# EAGLE schematic pulser (EAGLE 9.5.0)
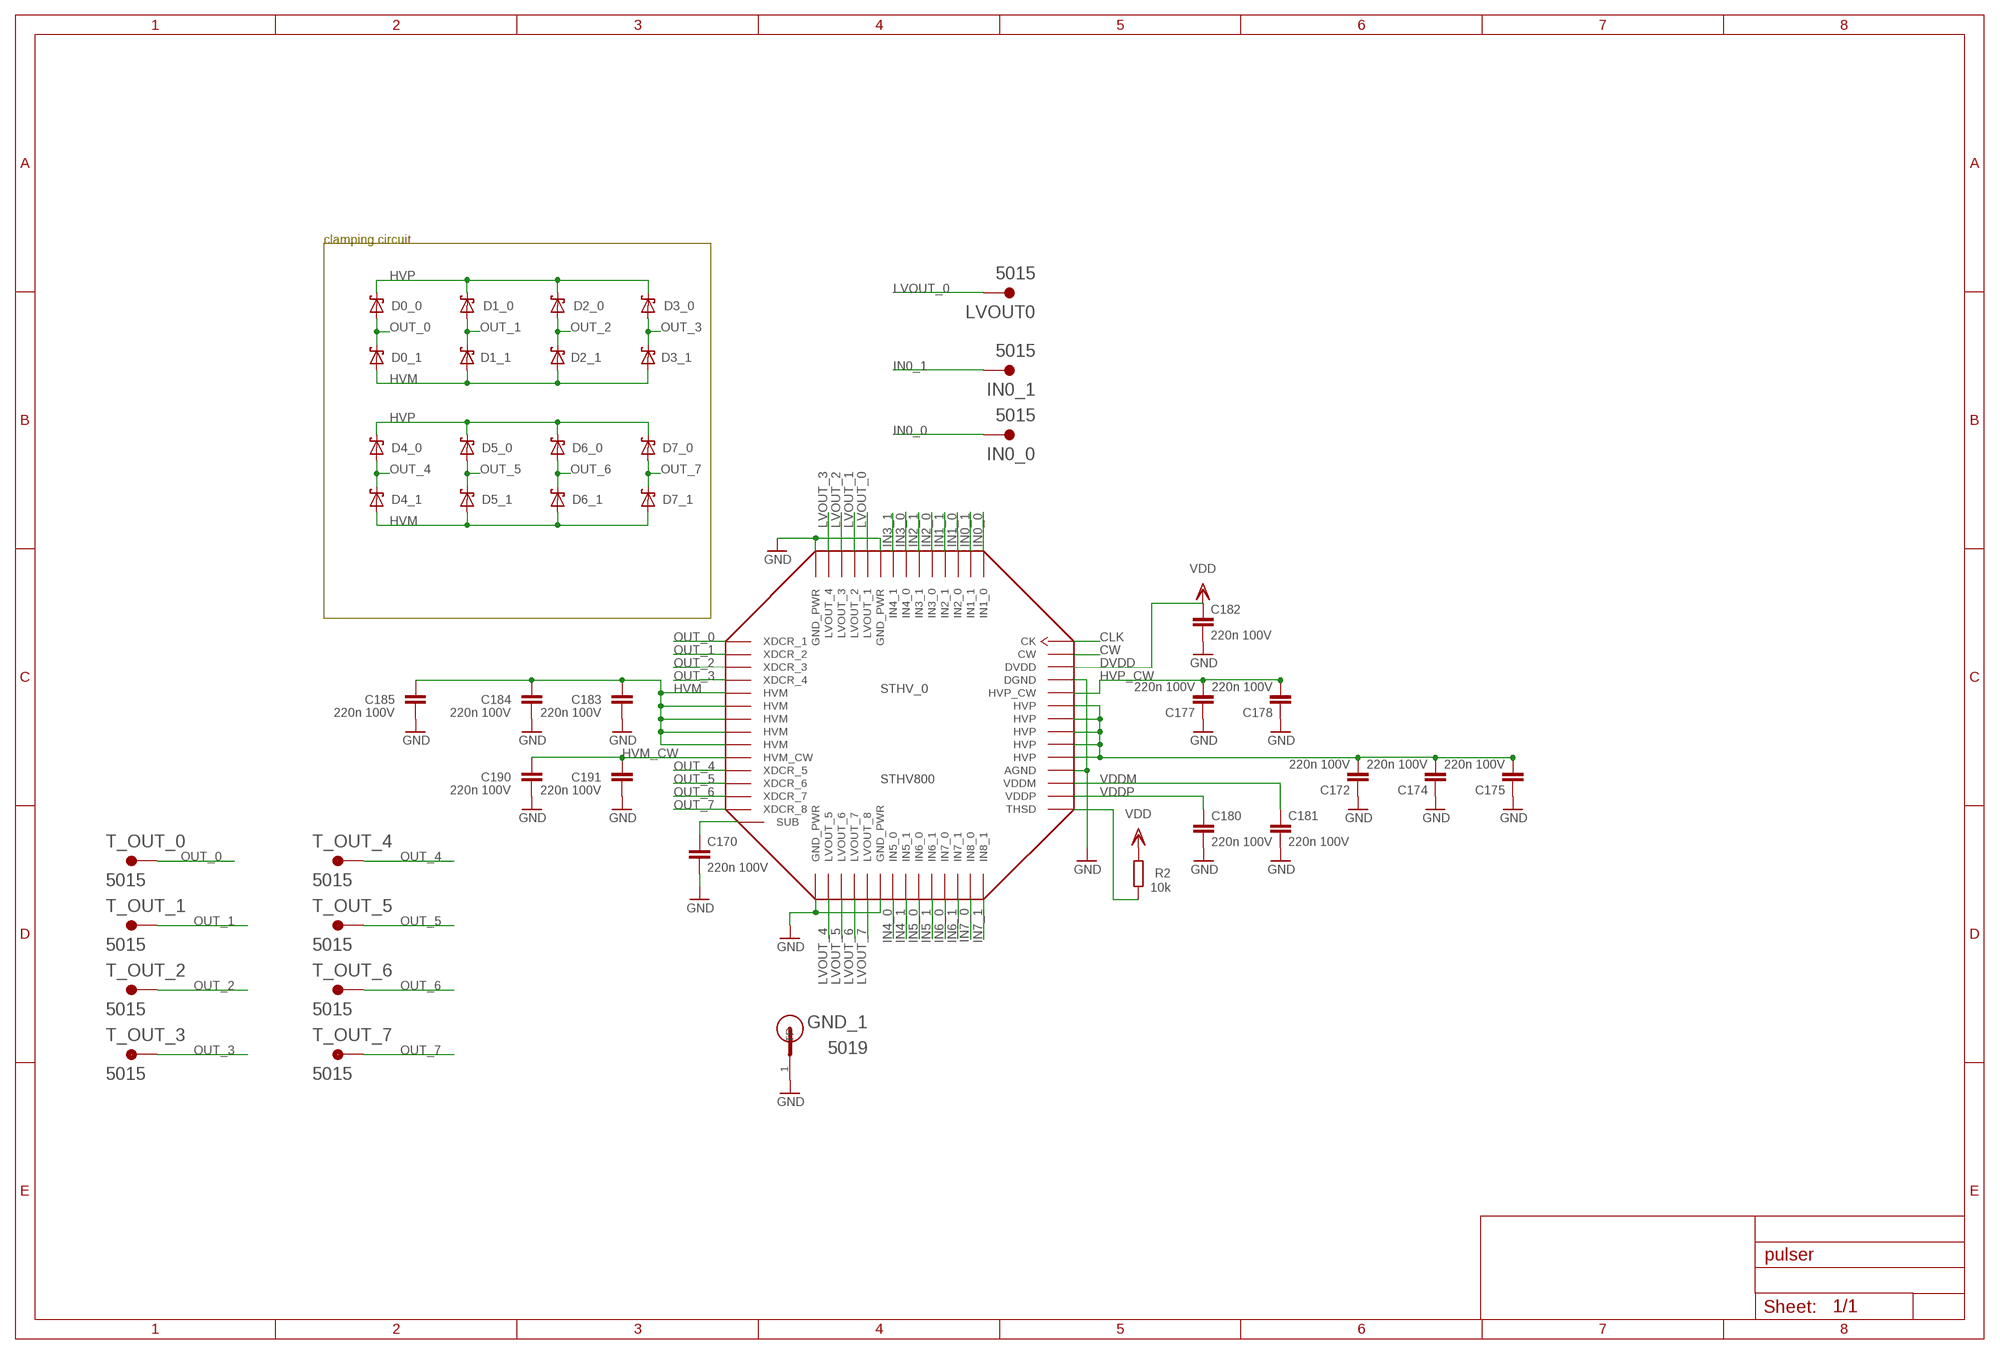
[diagram p0: schematic, sheet 1]

## Parts
C170  220n 100V  C-EUC0805  [C0805]
C172  220n 100V  C-EUC0805  [C0805]
C174  220n 100V  C-EUC0805  [C0805]
C175  220n 100V  C-EUC0805  [C0805]
C177  220n 100V  C-EUC0805  [C0805]
C178  220n 100V  C-EUC0805  [C0805]
C180  220n 100V  C-EUC0805  [C0805]
C181  220n 100V  C-EUC0805  [C0805]
C182  220n 100V  C-EUC0805  [C0805]
C183  220n 100V  C-EUC0805  [C0805]
C184  220n 100V  C-EUC0805  [C0805]
C185  220n 100V  C-EUC0805  [C0805]
C190  220n 100V  C-EUC0805  [C0805]
C191  220n 100V  C-EUC0805  [C0805]
D0_0  SBR1U200P1SBR1U200P1  [POWERDI-123]
D0_1  SBR1U200P1SBR1U200P1  [POWERDI-123]
D1_0  SBR1U200P1SBR1U200P1  [POWERDI-123]
D1_1  SBR1U200P1SBR1U200P1  [POWERDI-123]
D2_0  SBR1U200P1SBR1U200P1  [POWERDI-123]
D2_1  SBR1U200P1SBR1U200P1  [POWERDI-123]
D3_0  SBR1U200P1SBR1U200P1  [POWERDI-123]
D3_1  SBR1U200P1SBR1U200P1  [POWERDI-123]
D4_0  SBR1U200P1SBR1U200P1  [POWERDI-123]
D4_1  SBR1U200P1SBR1U200P1  [POWERDI-123]
D5_0  SBR1U200P1SBR1U200P1  [POWERDI-123]
D5_1  SBR1U200P1SBR1U200P1  [POWERDI-123]
D6_0  SBR1U200P1SBR1U200P1  [POWERDI-123]
D6_1  SBR1U200P1SBR1U200P1  [POWERDI-123]
D7_0  SBR1U200P1SBR1U200P1  [POWERDI-123]
D7_1  SBR1U200P1SBR1U200P1  [POWERDI-123]
GND_1  5019  [TP380X203]
IN0_0  5015  [KEYSTONE_5015]
IN0_1  5015  [KEYSTONE_5015]
LVOUT0  5015  [KEYSTONE_5015]
R2  10k  R-EU_R0805  [R0805]
STHV_0  STHV800  [TFLGA-56LD]
T_OUT_0  5015  [KEYSTONE_5015]
T_OUT_1  5015  [KEYSTONE_5015]
T_OUT_2  5015  [KEYSTONE_5015]
T_OUT_3  5015  [KEYSTONE_5015]
T_OUT_4  5015  [KEYSTONE_5015]
T_OUT_5  5015  [KEYSTONE_5015]
T_OUT_6  5015  [KEYSTONE_5015]
T_OUT_7  5015  [KEYSTONE_5015]

## Nets
CLK: STHV_0.CK
CW: STHV_0.CW
DVDD: C182.1 STHV_0.DVDD
GND [power_cw]: C170.2 C172.1 C174.1 C175.1 C177.1 C178.1 C180.2 C181.2 C182.2 C183.2 C184.2 C185.2 C190.1 C191.1 GND_1.1(TP) STHV_0.AGND STHV_0.DGND STHV_0.GND_PWR@1(GND_PWR) STHV_0.GND_PWR@2(GND_PWR) STHV_0.GND_PWR@3(GND_PWR) STHV_0.GND_PWR@4(GND_PWR)
HVM [power]: C183.1 C184.1 C185.1 D0_1.A D1_1.A D2_1.A D3_1.A D4_1.A D5_1.A D6_1.A D7_1.A STHV_0.HVM@1(HVM) STHV_0.HVM@2(HVM) STHV_0.HVM@3(HVM) STHV_0.HVM@4(HVM) STHV_0.HVM@5(HVM)
HVM_CW [power_cw]: C190.2 C191.2 STHV_0.HVM_CW
HVP [power]: C172.2 C174.2 C175.2 D0_0.C D1_0.C D2_0.C D3_0.C D4_0.C D5_0.C D6_0.C D7_0.C STHV_0.HVP@1(HVP) STHV_0.HVP@2(HVP) STHV_0.HVP@3(HVP) STHV_0.HVP@4(HVP) STHV_0.HVP@5(HVP)
HVP_CW: C177.2 C178.2 STHV_0.HVP_CW
IN0_0: IN0_0.1(TP) STHV_0.IN1_0
IN0_1: IN0_1.1(TP) STHV_0.IN1_1
IN1_0: STHV_0.IN2_0
IN1_1: STHV_0.IN2_1
IN2_0: STHV_0.IN3_0
IN2_1: STHV_0.IN3_1
IN3_0: STHV_0.IN4_0
IN3_1: STHV_0.IN4_1
IN4_0: STHV_0.IN5_0
IN4_1: STHV_0.IN5_1
IN5_0: STHV_0.IN6_0
IN5_1: STHV_0.IN6_1
IN6_0: STHV_0.IN7_0
IN6_1: STHV_0.IN7_1
IN7_0: STHV_0.IN8_0
IN7_1: STHV_0.IN8_1
LVOUT_0 [low_voltage]: LVOUT0.1(TP) STHV_0.LVOUT_1
LVOUT_1 [low_voltage]: STHV_0.LVOUT_2
LVOUT_2 [low_voltage]: STHV_0.LVOUT_3
LVOUT_3 [low_voltage]: STHV_0.LVOUT_4
LVOUT_4 [low_voltage]: STHV_0.LVOUT_5
LVOUT_5 [low_voltage]: STHV_0.LVOUT_6
LVOUT_6 [low_voltage]: STHV_0.LVOUT_7
LVOUT_7 [low_voltage]: STHV_0.LVOUT_8
N$23: R2.1 STHV_0.THSD
N$24: C170.1 STHV_0.SUB
OUT_0: D0_0.A D0_1.C STHV_0.XDCR_1 T_OUT_0.1(TP)
OUT_1: D1_0.A D1_1.C STHV_0.XDCR_2 T_OUT_1.1(TP)
OUT_2: D2_0.A D2_1.C STHV_0.XDCR_3 T_OUT_2.1(TP)
OUT_3: D3_0.A D3_1.C STHV_0.XDCR_4 T_OUT_3.1(TP)
OUT_4: D4_0.A D4_1.C STHV_0.XDCR_5 T_OUT_4.1(TP)
OUT_5: D5_0.A D5_1.C STHV_0.XDCR_6 T_OUT_5.1(TP)
OUT_6: D6_0.A D6_1.C STHV_0.XDCR_7 T_OUT_6.1(TP)
OUT_7: D7_0.A D7_1.C STHV_0.XDCR_8 T_OUT_7.1(TP)
VDD: R2.2
VDDM [power_cw]: C181.1 STHV_0.VDDM
VDDP [power_cw]: C180.1 STHV_0.VDDP

## Notes on the sheet
- clamping circuit

## Library data of the parts
C170 C172 C174 C175 C177 C178 C180-C185 C190 C191 = rcl:C-EU: CAPACITOR, European symbol; SPICEPREFIX: C
D0_0 D0_1 D1_0 D1_1 D2_0 D2_1 D3_0 D3_1 D4_0 D4_1 D5_0 D5_1 D6_0 D6_1 D7_0 D7_1 = dfls130l-7:SBR1U200P1: Super Barrier Rectifier Diode; MF: Diodes Inc; MOUSER: SBR1U200P1-7; MPN: SBR1U200P1
GND_1 = 5019:5019: Test Point, Compact, Surface Mount; AVAILABILITY: Good; DESCRIPTION: Phosphor Bronze Contact Miniature Silver Plated Surface Mount Test Points; MF: Keystone; MP: 5019; PACKAGE: 2010 Keystone; PRICE: 0.18 USD
IN0_0 IN0_1 LVOUT0 T_OUT_0 T_OUT_1-T_OUT_7 = keystone_5015:5015: Test Point; Black; Surface Mount; Wire Leaded; Polycarbonate; 0.04 in.; AVAILABILITY: Unavailable; DESCRIPTION: Test Point; Black; Surface Mount; Wire Leaded; Polycarbonate; 0.04 in.; MF: Keystone Electronics; MP: 5015; PACKAGE: Keystone Electronics; PRICE: None
R2 = rcl:R-EU_: RESISTOR, European symbol
STHV_0 = wouter:STHV800

## Net classes
1 power_cw: width 0.2 mm
2 power: width 0.3 mm